# Altium schematic sheet LEDs_FMU_REV_2A.SchDoc: Cube Yellow and Cube Orange
size A3; Date: 18/08/2014 1:53:21 PM; Author: PR; DrawnBy: Philip Rowse; Engineer: Philip Rowse; Organization: ProfiCNC/Hex; Address3: VIC; Address4: Australia; Revision: A; SheetNumber: 6; SheetTotal: 10
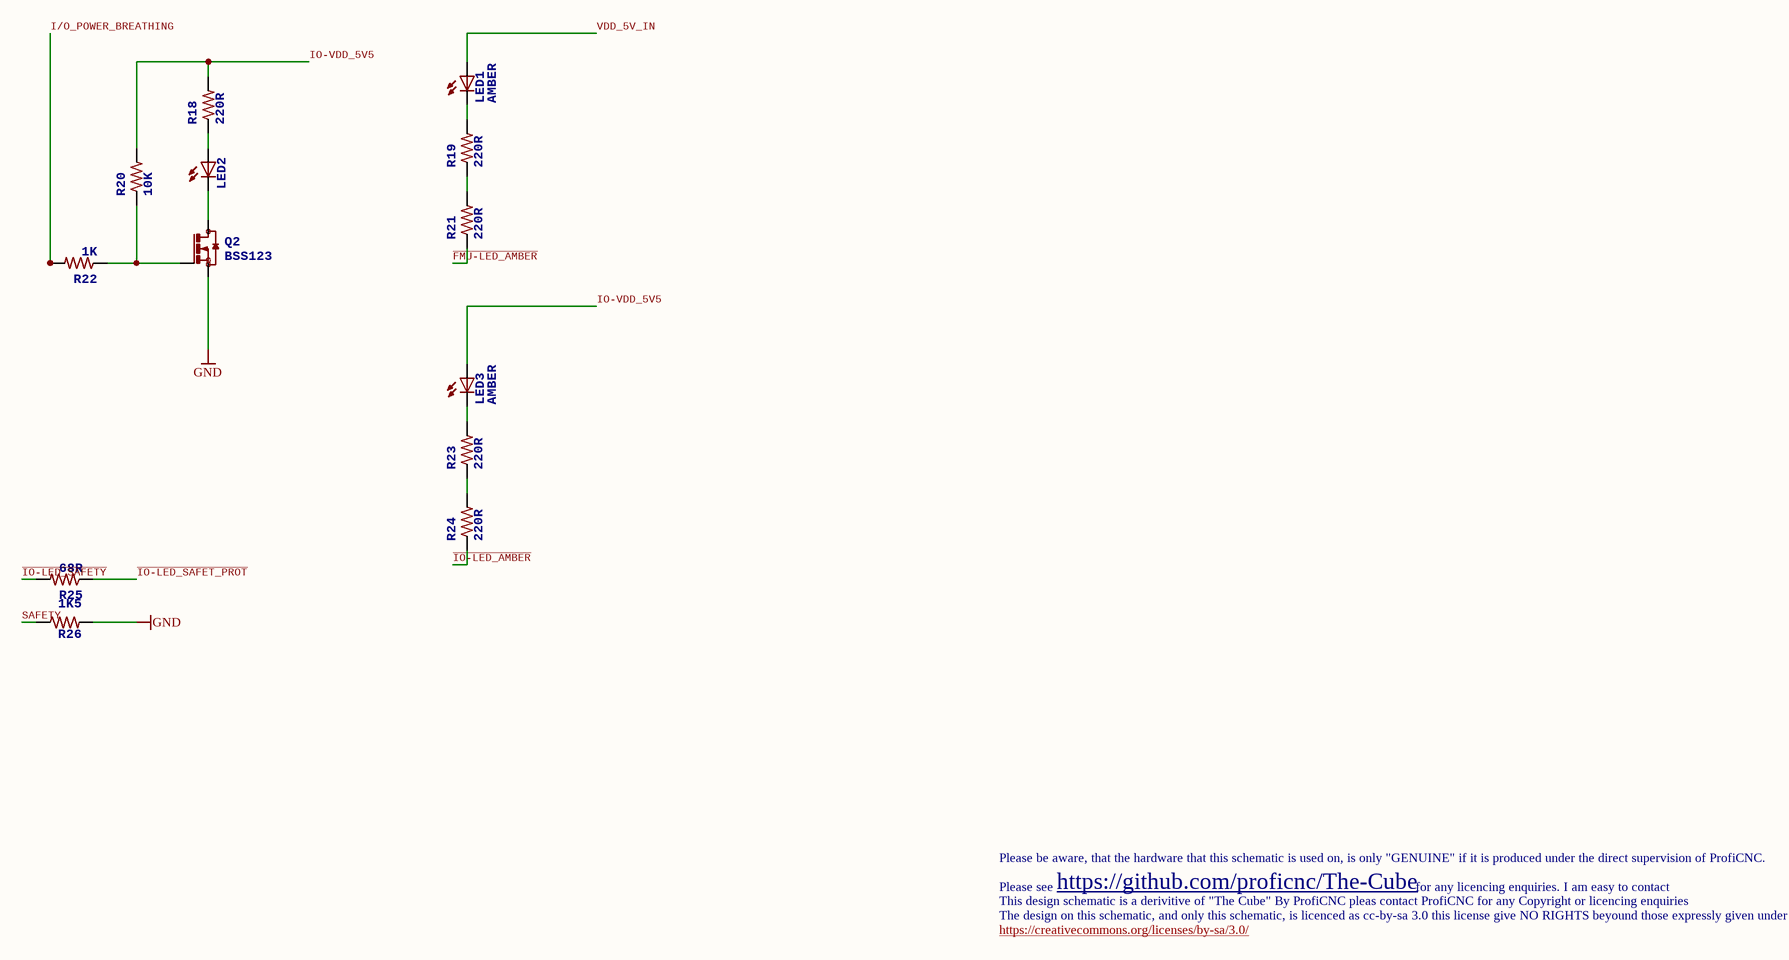
[diagram p0: LEDs_FMU_REV_2A.SchDoc]

## Parts
LED1  AMBER  [0603-LED]
LED2  LED0603_Green  [0603-LED-Blue]  (value not drawn)
LED3  AMBER  [0603-LED]
Q2  BSS123  [SOT23]
R18  220R  [0402-RES]
R19  220R  [0402-RES]
R20  10K  [0402-RES]
R21  220R  [0402-RES]
R22  1K  [0402-RES]
R23  220R  [0402-RES]
R24  220R  [0402-RES]
R25  68R  [0402-RES]
R26  1K5  [0402-RES]

## Nets
GND: Q2.2(S) R26.P$2
~{FMU-LED_AMBER}: R21.P$1
I/O_POWER_BREATHING: R22.P$2
~{IO-LED_AMBER}: R24.P$1
~{IO-LED_SAFET_PROT}: R25.P$1
~{IO-LED_SAFETY}: R25.P$2
IO-VDD_5V5: LED3.A R18.P$2 R20.P$2
SAFETY: R26.P$1
VDD_5V_IN: LED1.A
NetLED1_C: LED1.C R19.P$2
NetLED2_A: LED2.A R18.P$1
NetLED2_C: LED2.C Q2.3(D)
NetLED3_C: LED3.C R23.P$2
NetQ2_1: Q2.1(G) R20.P$1 R22.P$1
NetR19_P$1: R19.P$1 R21.P$2
NetR23_P$1: R23.P$1 R24.P$2

## Notes on the sheet
- Please be aware, that the hardware that this schematic is used on, is only "GENUINE" if it is produced under the direct supervision of ProfiCNC.
- The design on this schematic, and only this schematic, is licenced as cc-by-sa 3.0 this license give NO RIGHTS beyound those expressly given under the terms of this license.
- This design schematic is a derivitive of "The Cube" By ProfiCNC pleas contact ProfiCNC for any Copyright or licencing enquiries
- https://creativecommons.org/licenses/by-sa/3.0/
- Please see
- https://github.com/proficnc/The-Cube
- for any licencing enquiries. I am easy to contact
- Drawn By:
- Verified for production by:
- Approved for release:
- Title
- Size:
- Date:
- A
- Number:
- Time:
- Revision:
- Sheet
- of
- File:

## Library data of the parts
LED1 LED3 = LED0603: LED 1.6X0.8 DOME ORN CLEAR SMD; Value: AMBER
LED2 = LED0603_Blue: LED GREEN ROUND CLEAR SMD; Value: GREEN
Q2 = BSS123: MOSFET N-CH 100V 170MA SOT23-3; Value: 100V
R18 R19 R21 R23 R24 = RESISTOR0402-RES: RES 220 OHM 1/16W 1% 0402 SMD; Value: 220R
R20 = RESISTOR0402-RES: RES 10K OHM 1/16W 1% 0402 SMD; Value: 10K
R22 = RESISTOR0402-RES: RES 1K OHM 1/16W 1% 0402; Value: 1K
R25 = RESISTOR0402-RES: Thick Film Resistors - SMD 0402 68ohms 5% Tol; Value: 68R
R26 = RESISTOR0402-RES: RES 1.5K OHM 1/16W 1% 0402 SMD; Value: 1K5